# EasyEDA schematic 1-Schematic_Vulcan_Digital_Output.json

## Sheets
1 Connectors: TITLE: Connectors; REV: 1.0; Date: 2021-01-15; Sheet: 1/1; Drawn By: phillo; Company: NPIC
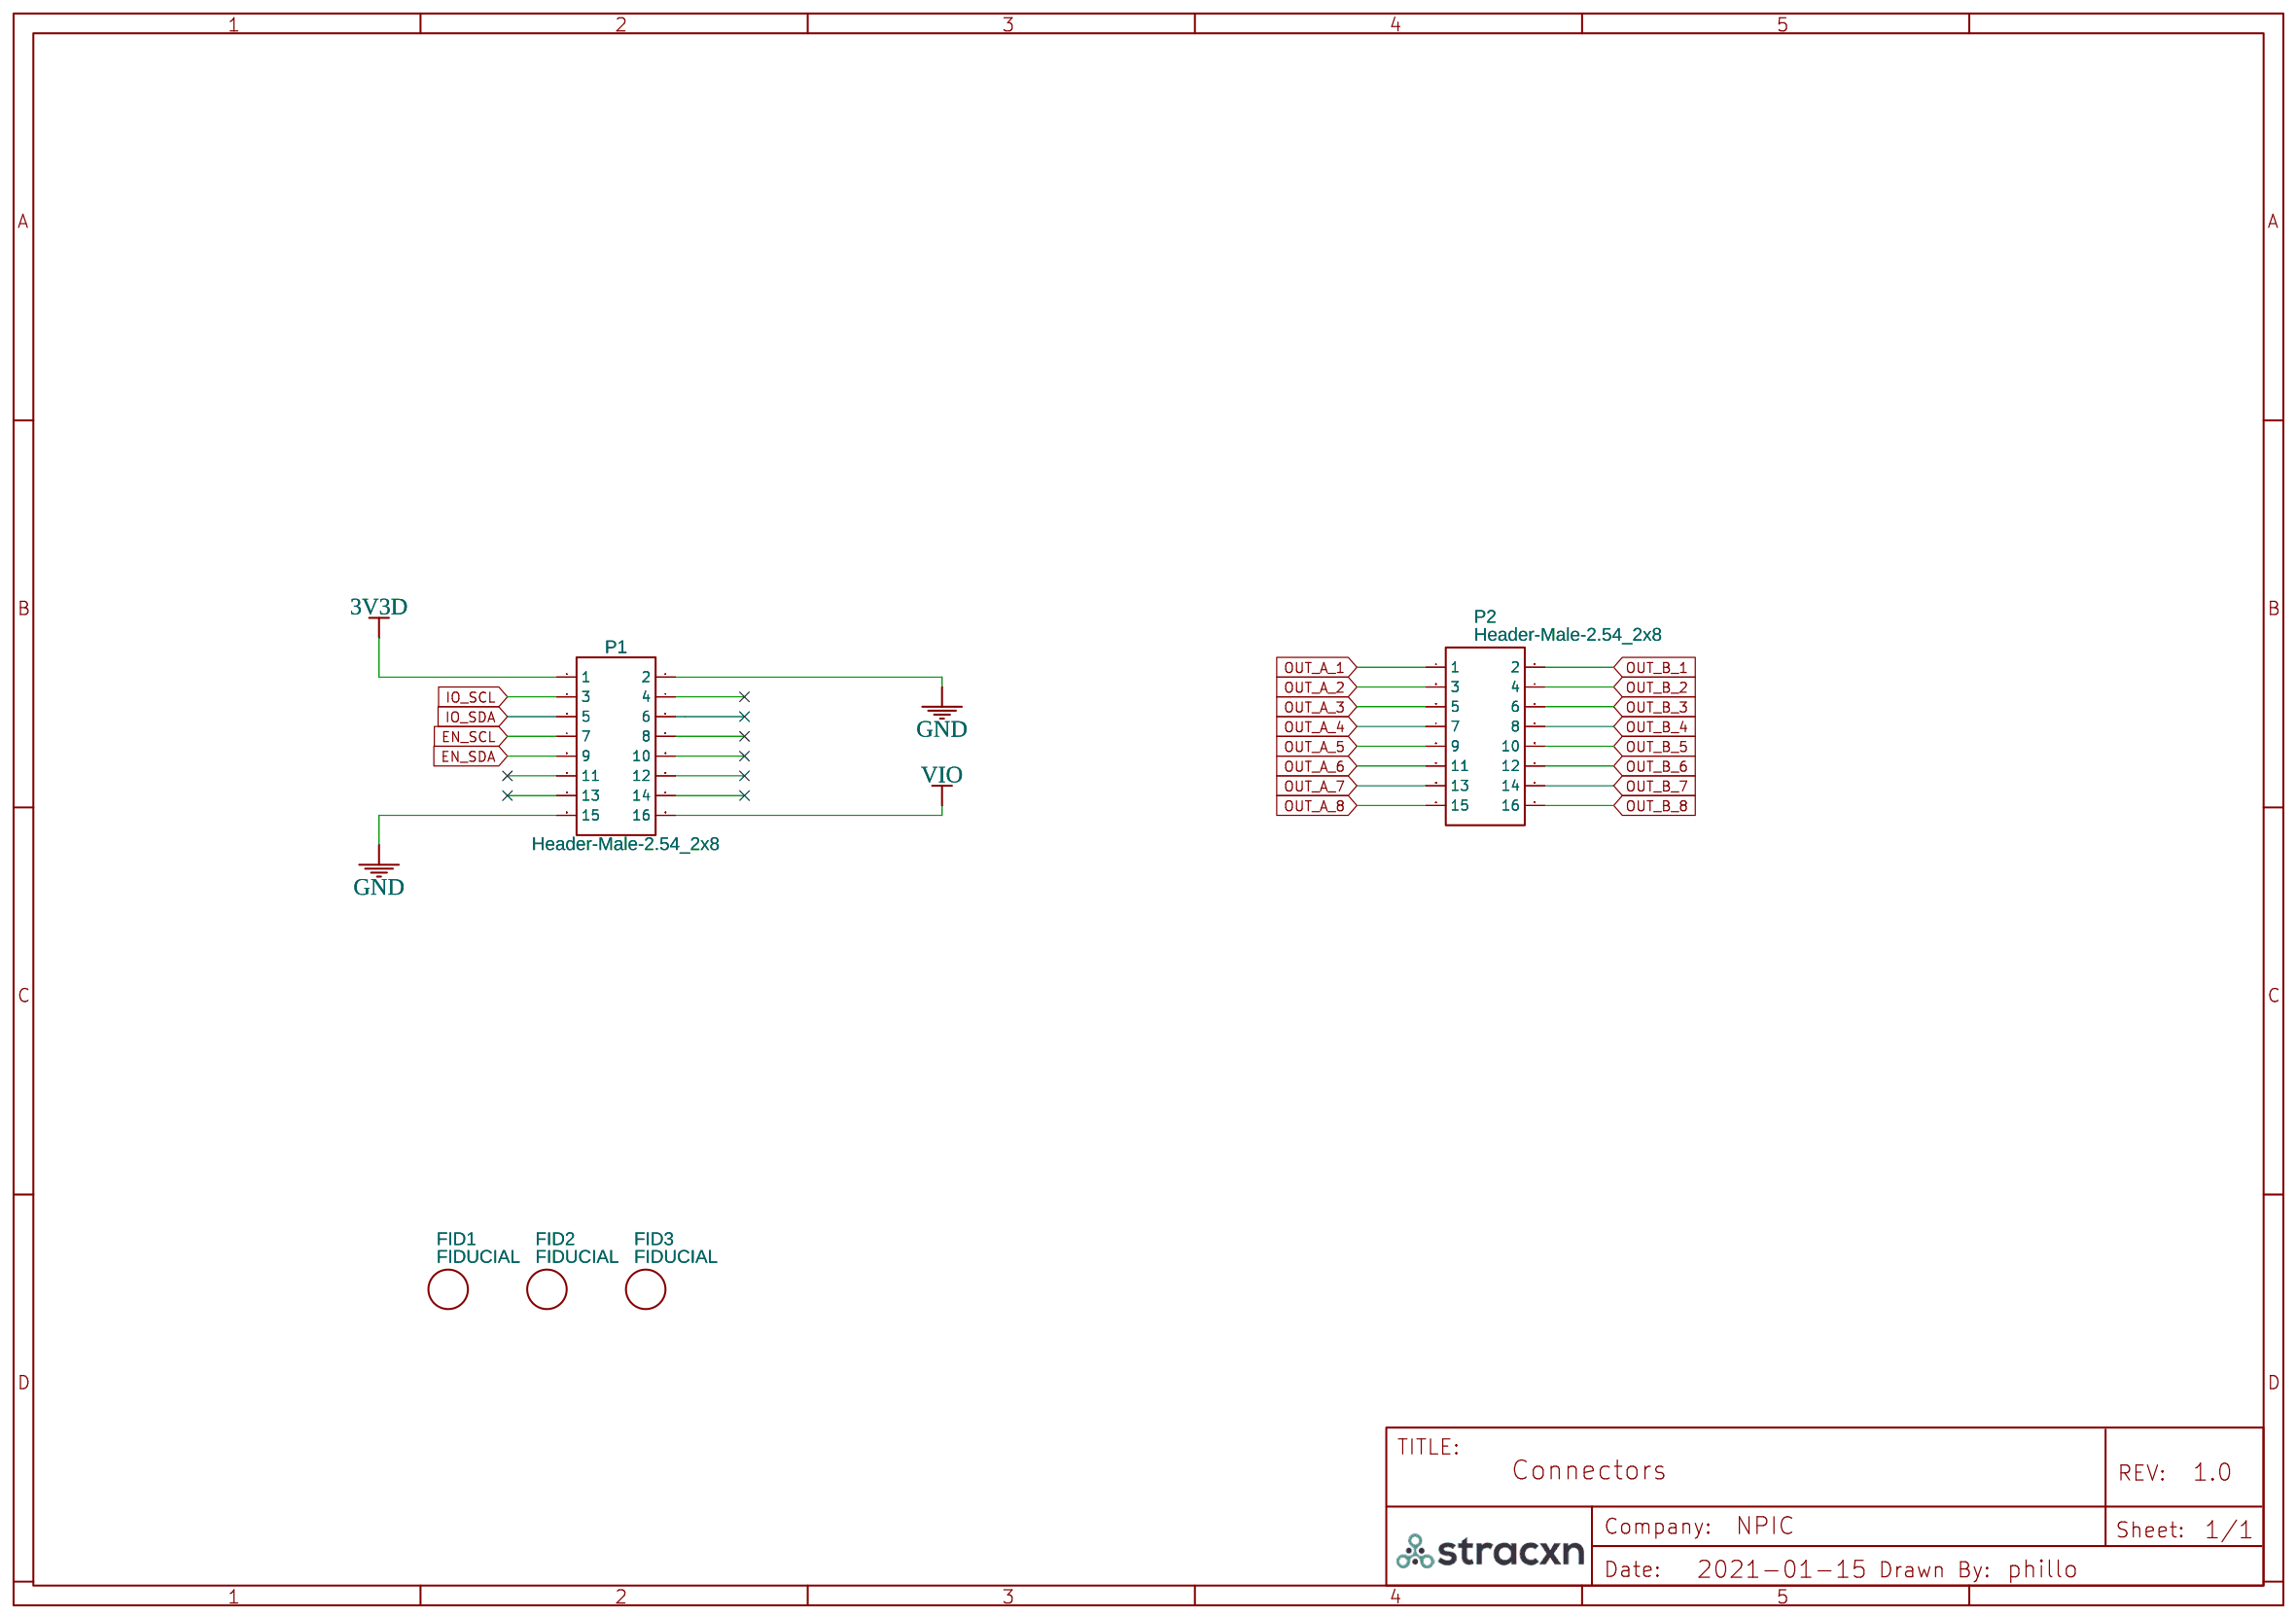
[diagram p0: Connectors]
2 Bank A: TITLE: Bank A
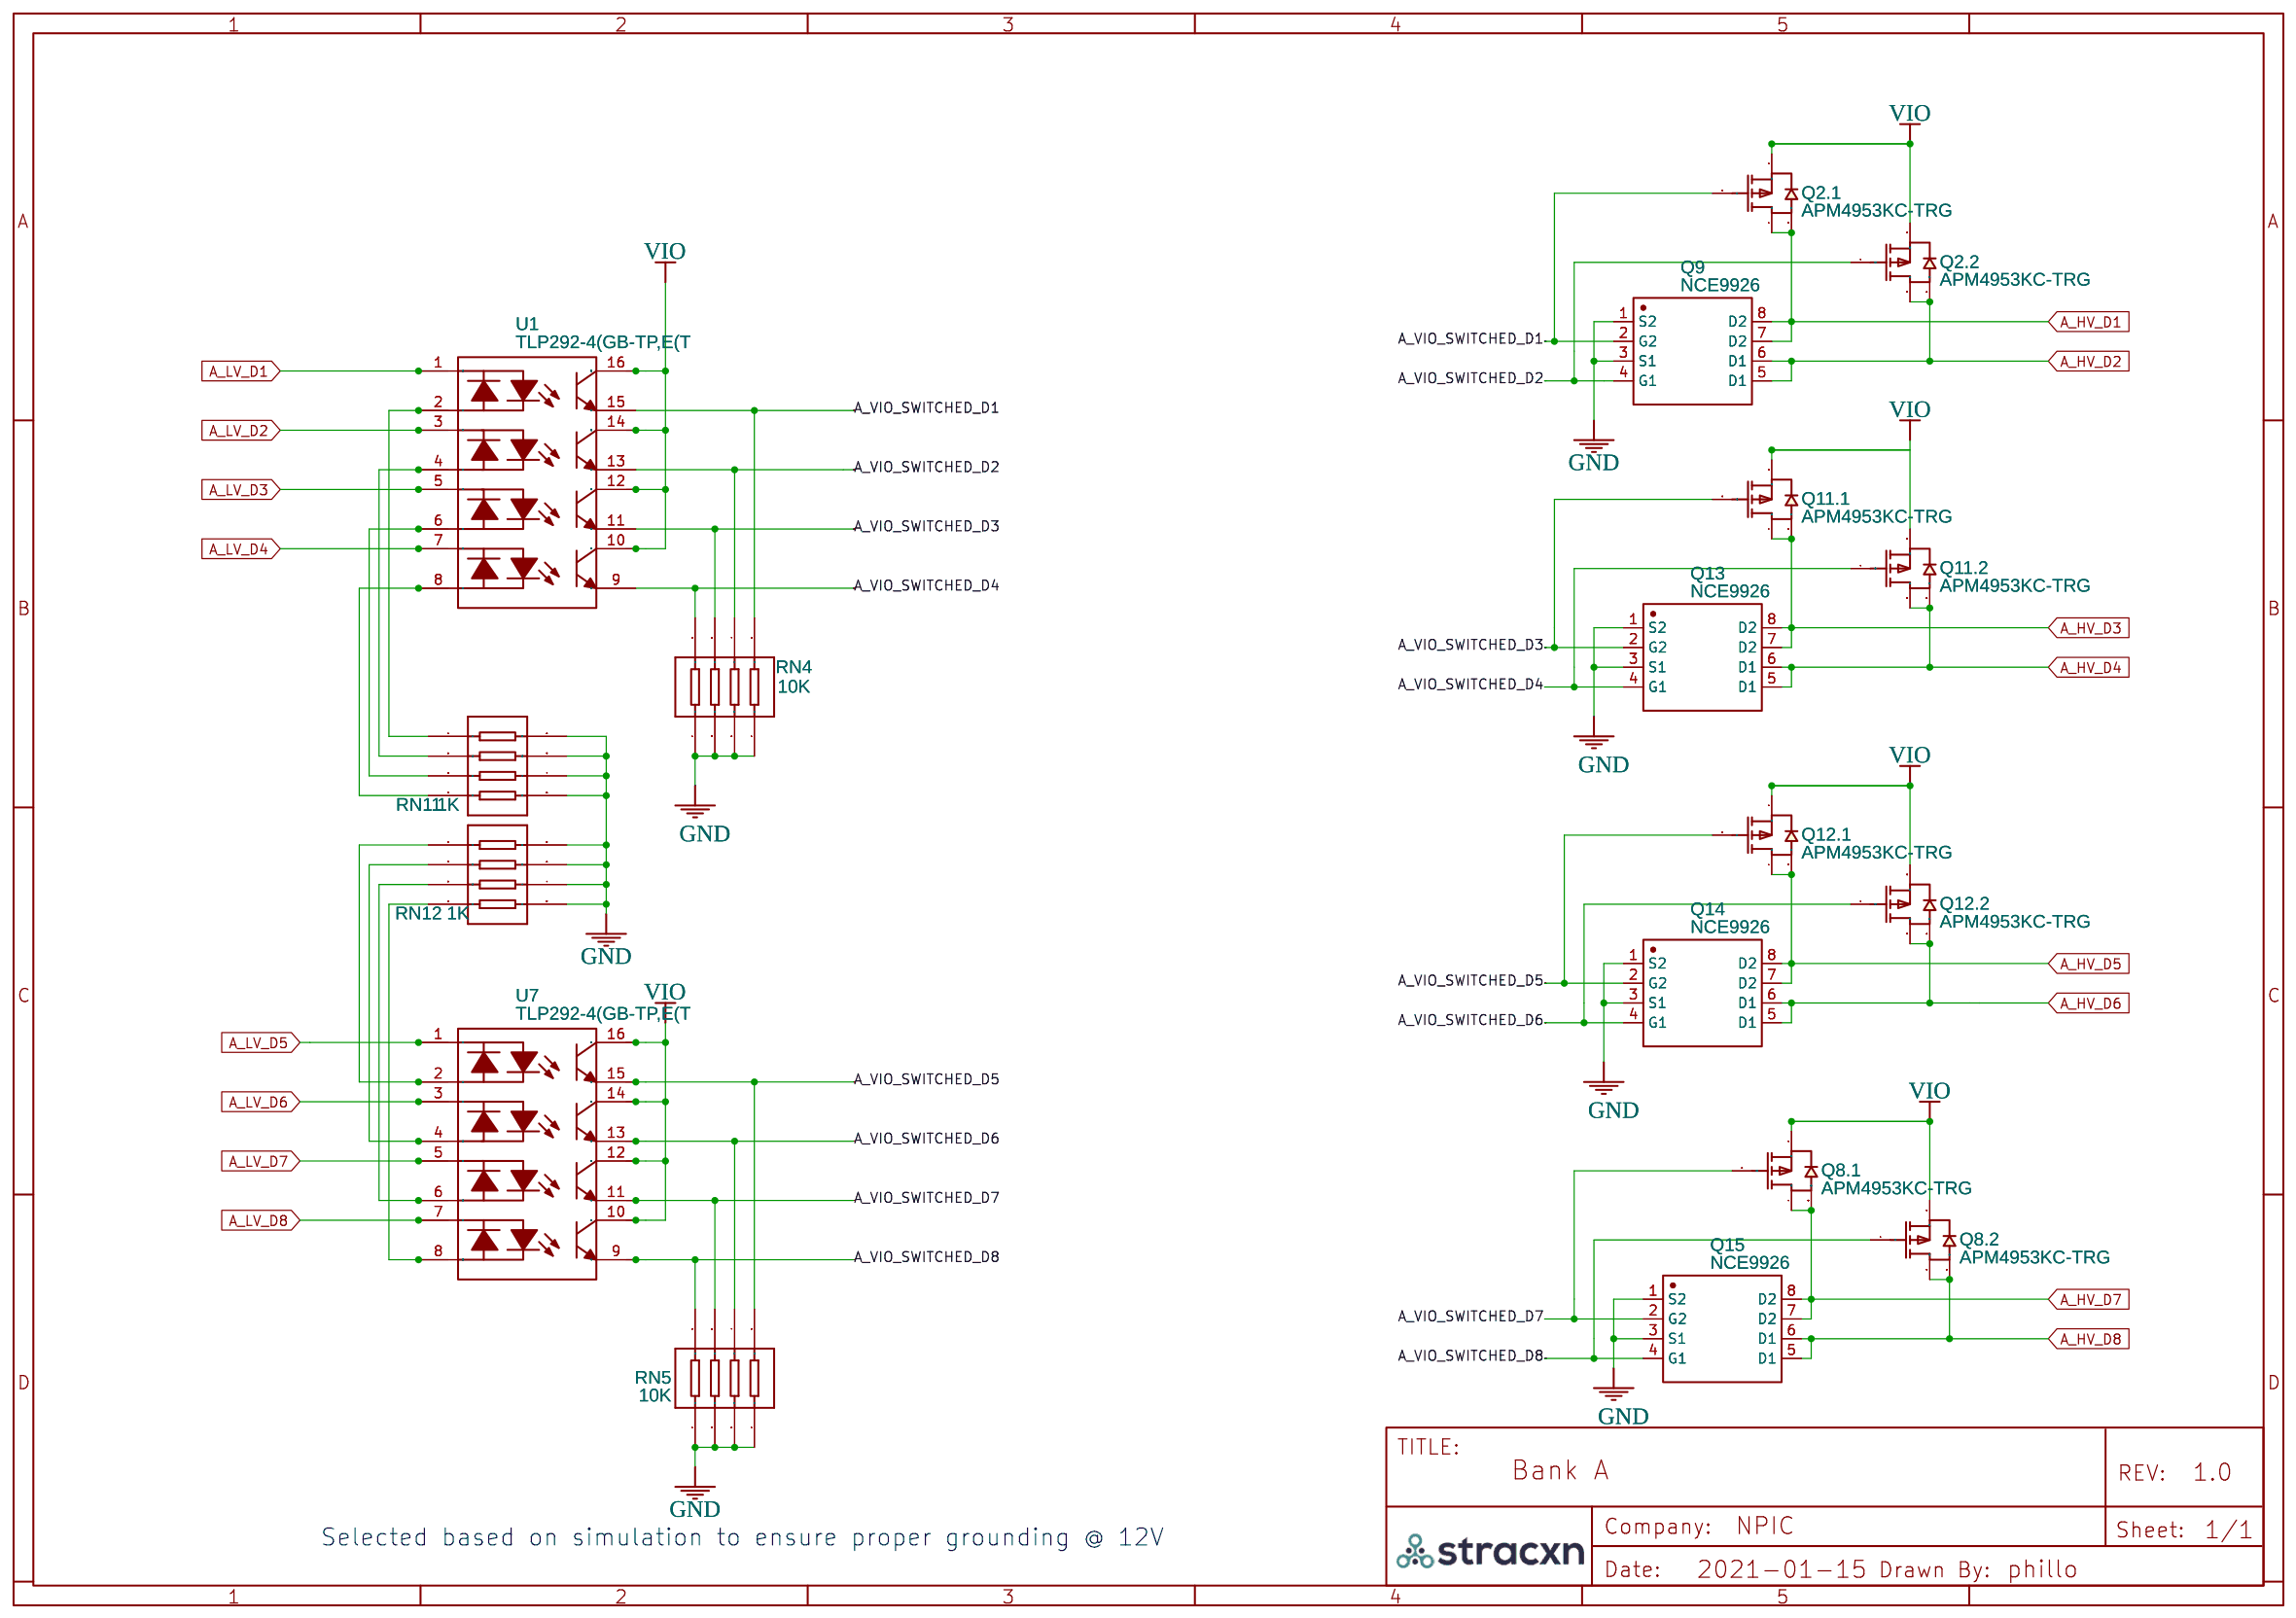
[diagram p1: Bank A]
3 IO Expanders: TITLE: IO Expanders; Drawn By: Phill Ogden
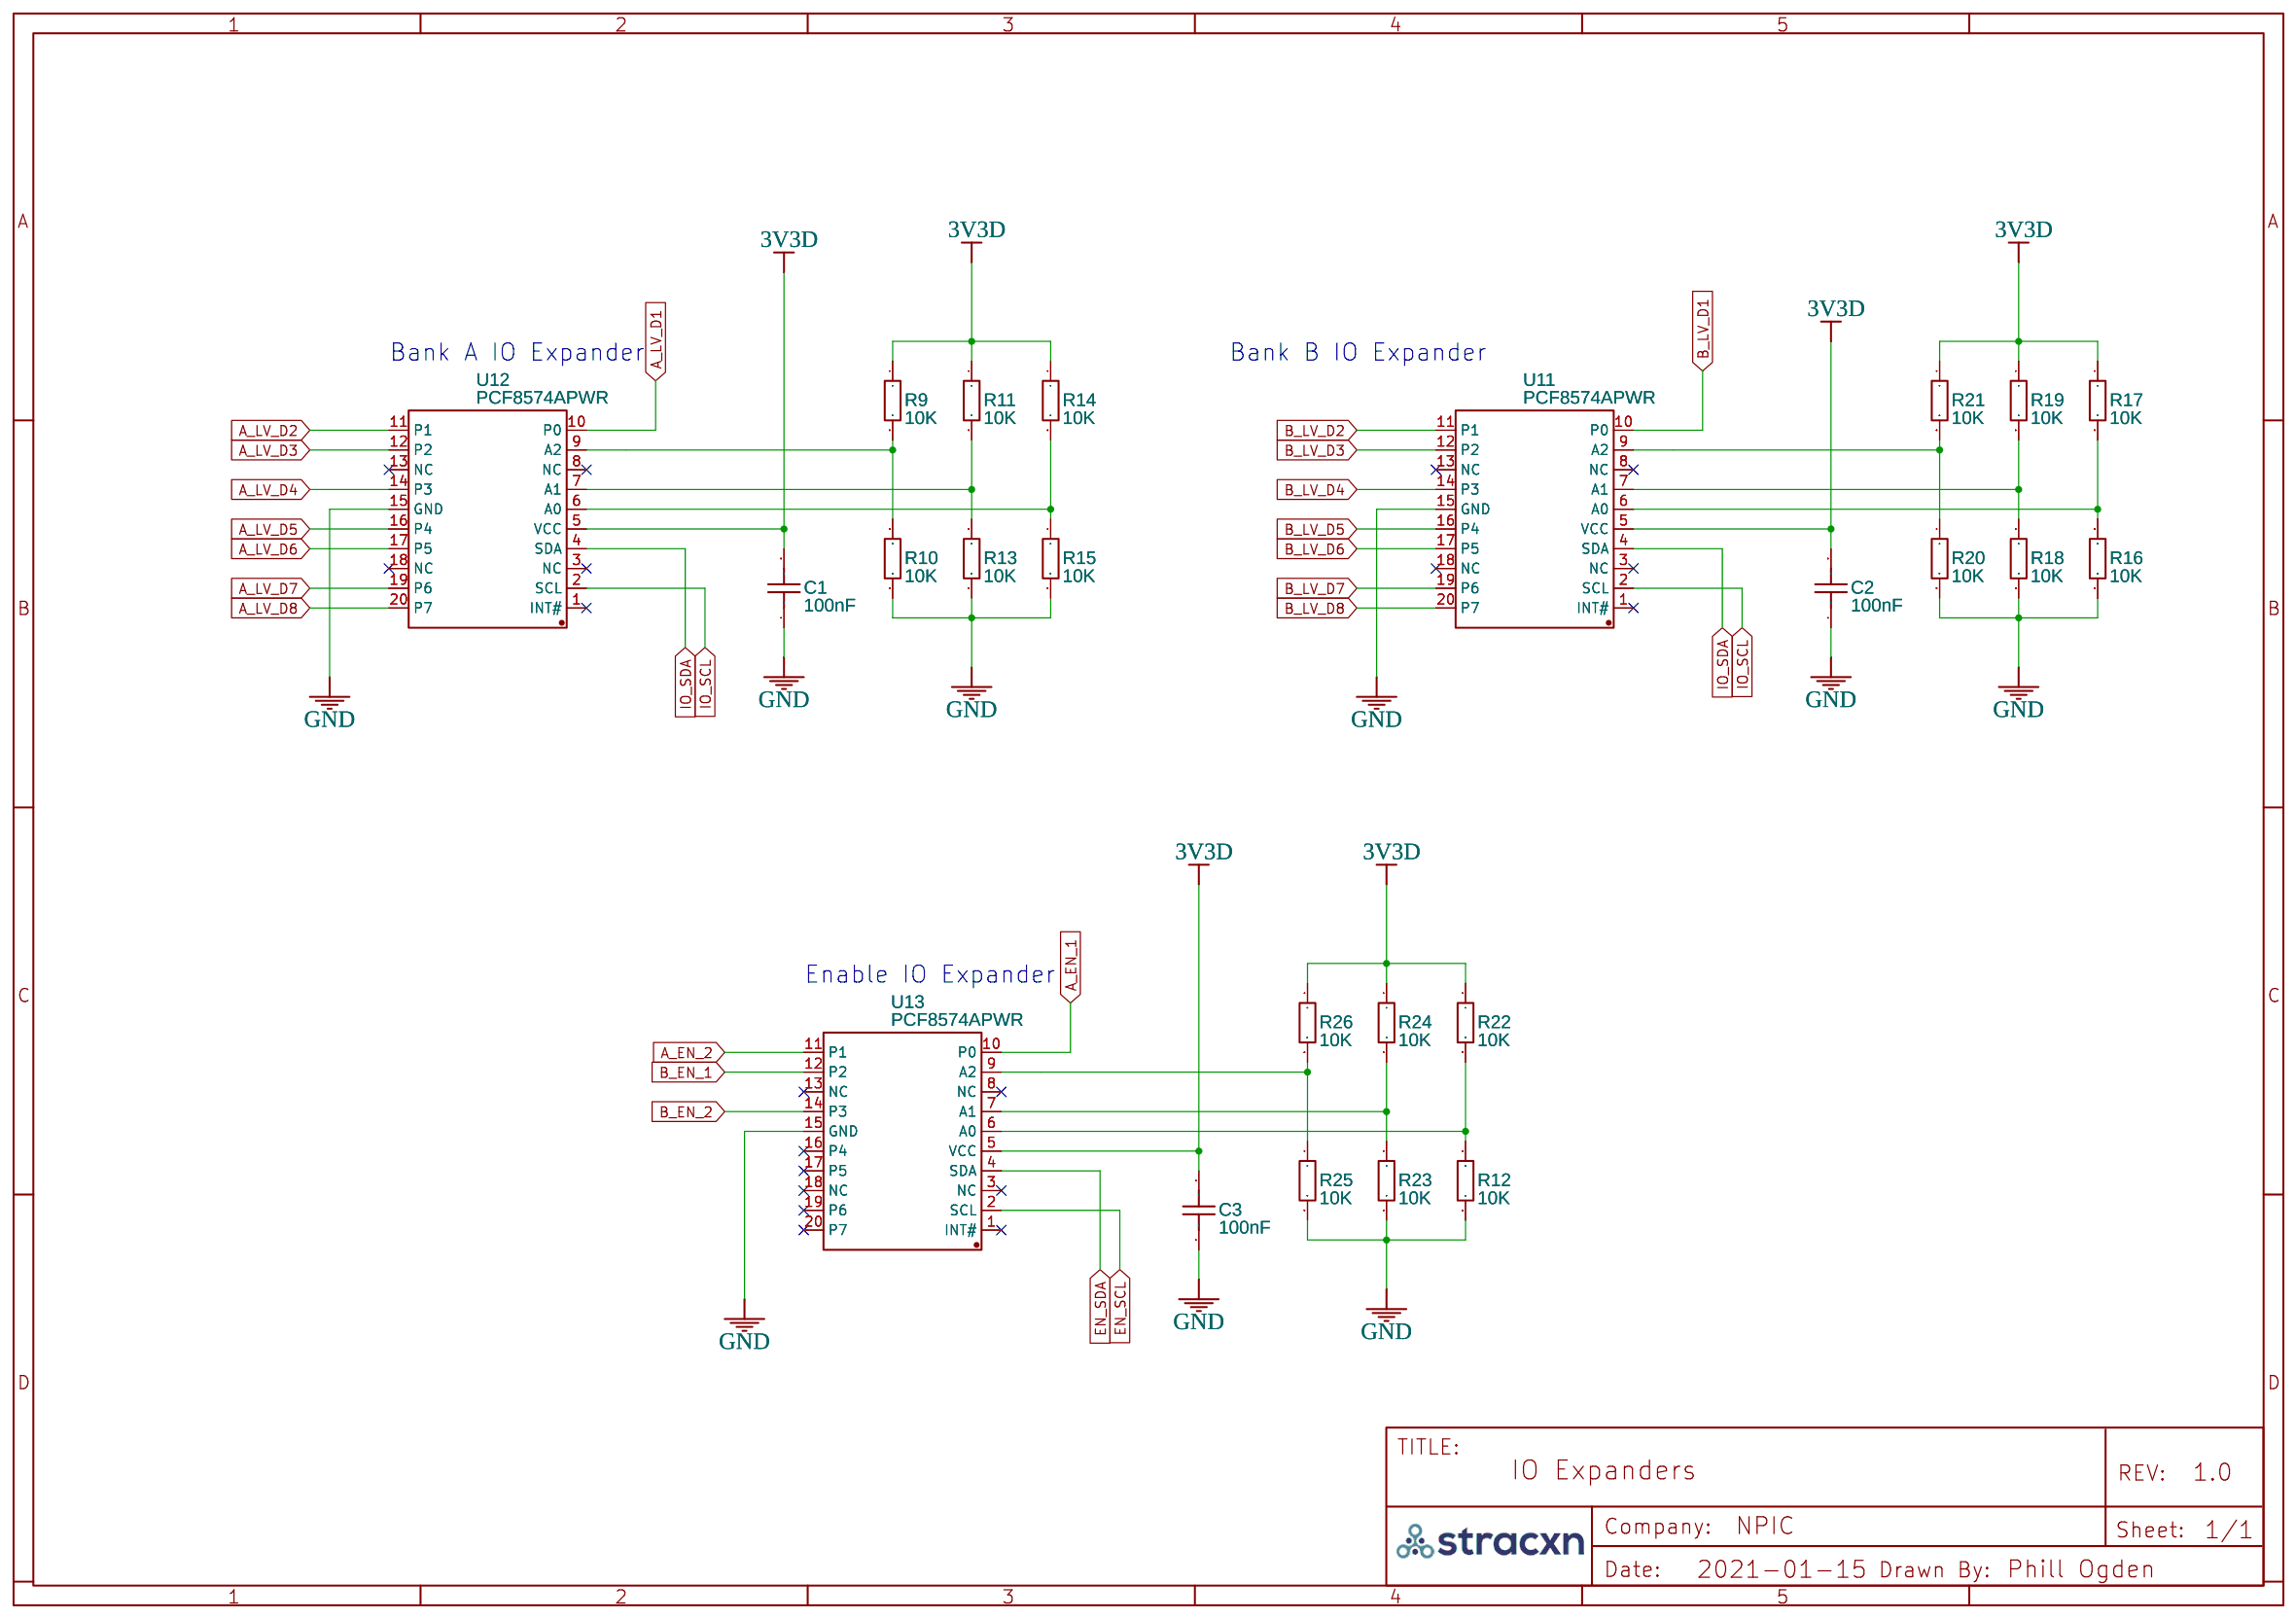
[diagram p2: IO Expanders]
4 Bank B: TITLE: Bank B; Drawn By: Phill Ogden
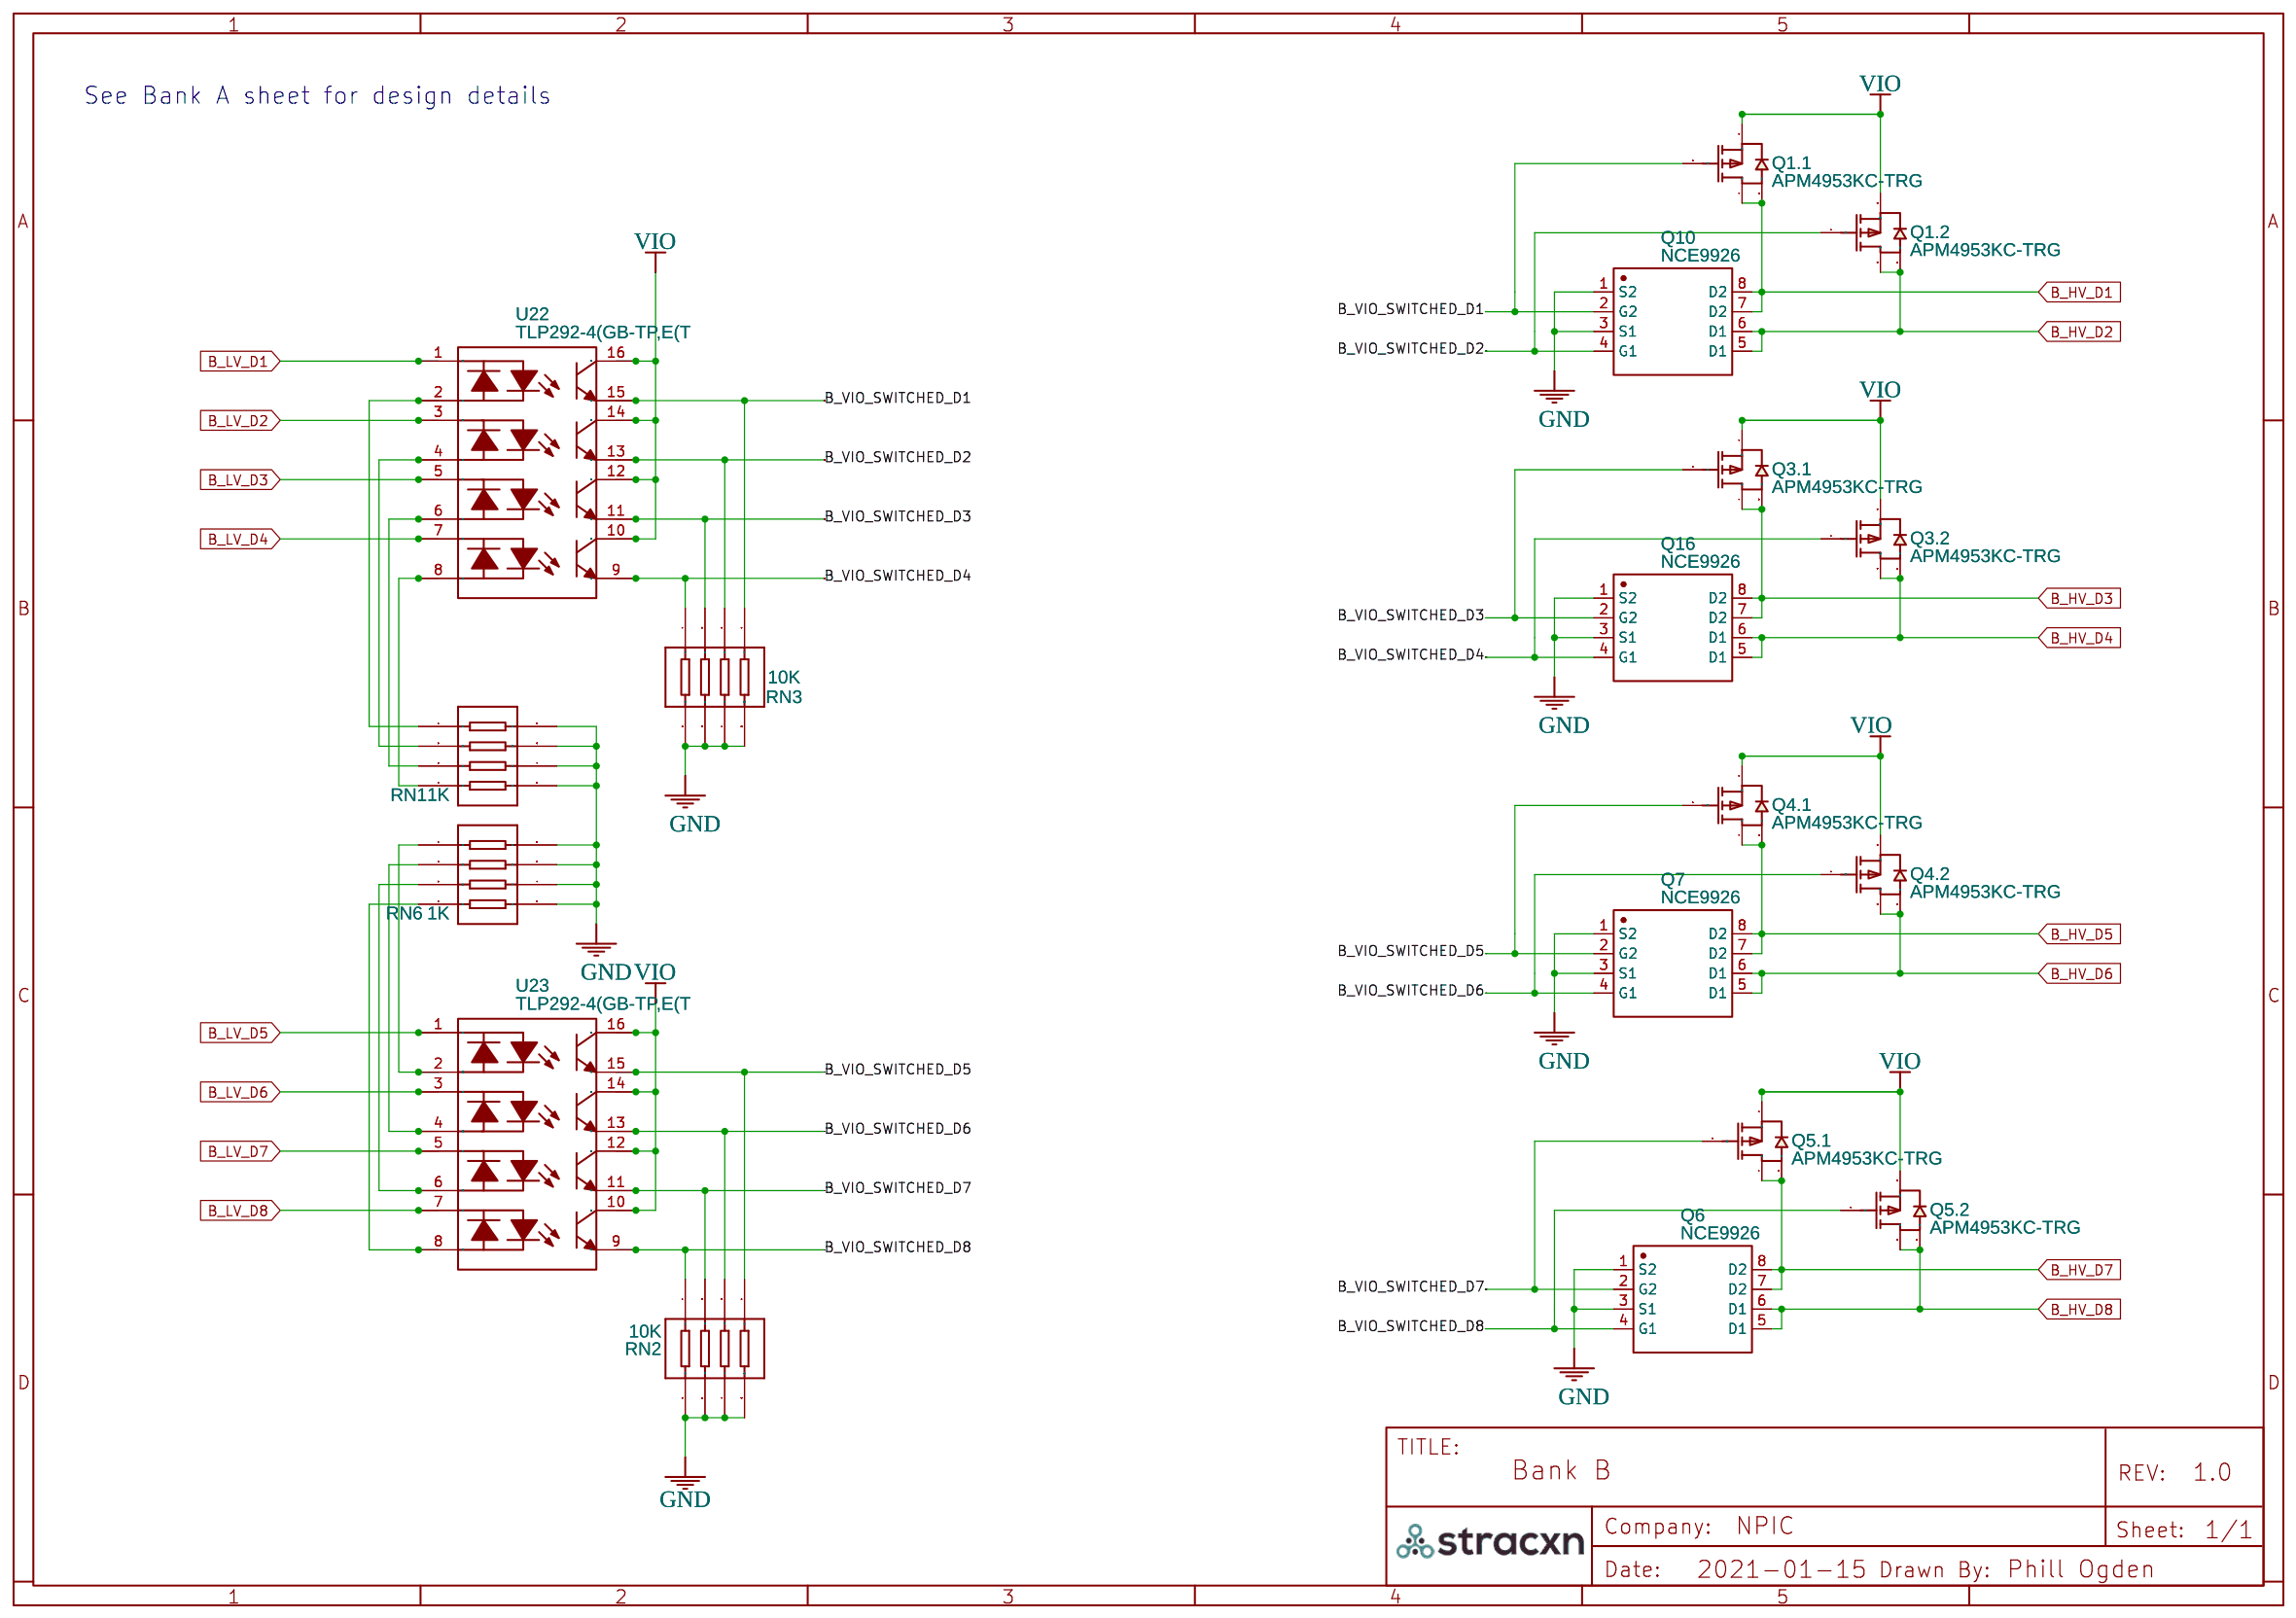
[diagram p3: Bank B]
5 Output: TITLE: Output; Date: 2021-01-18
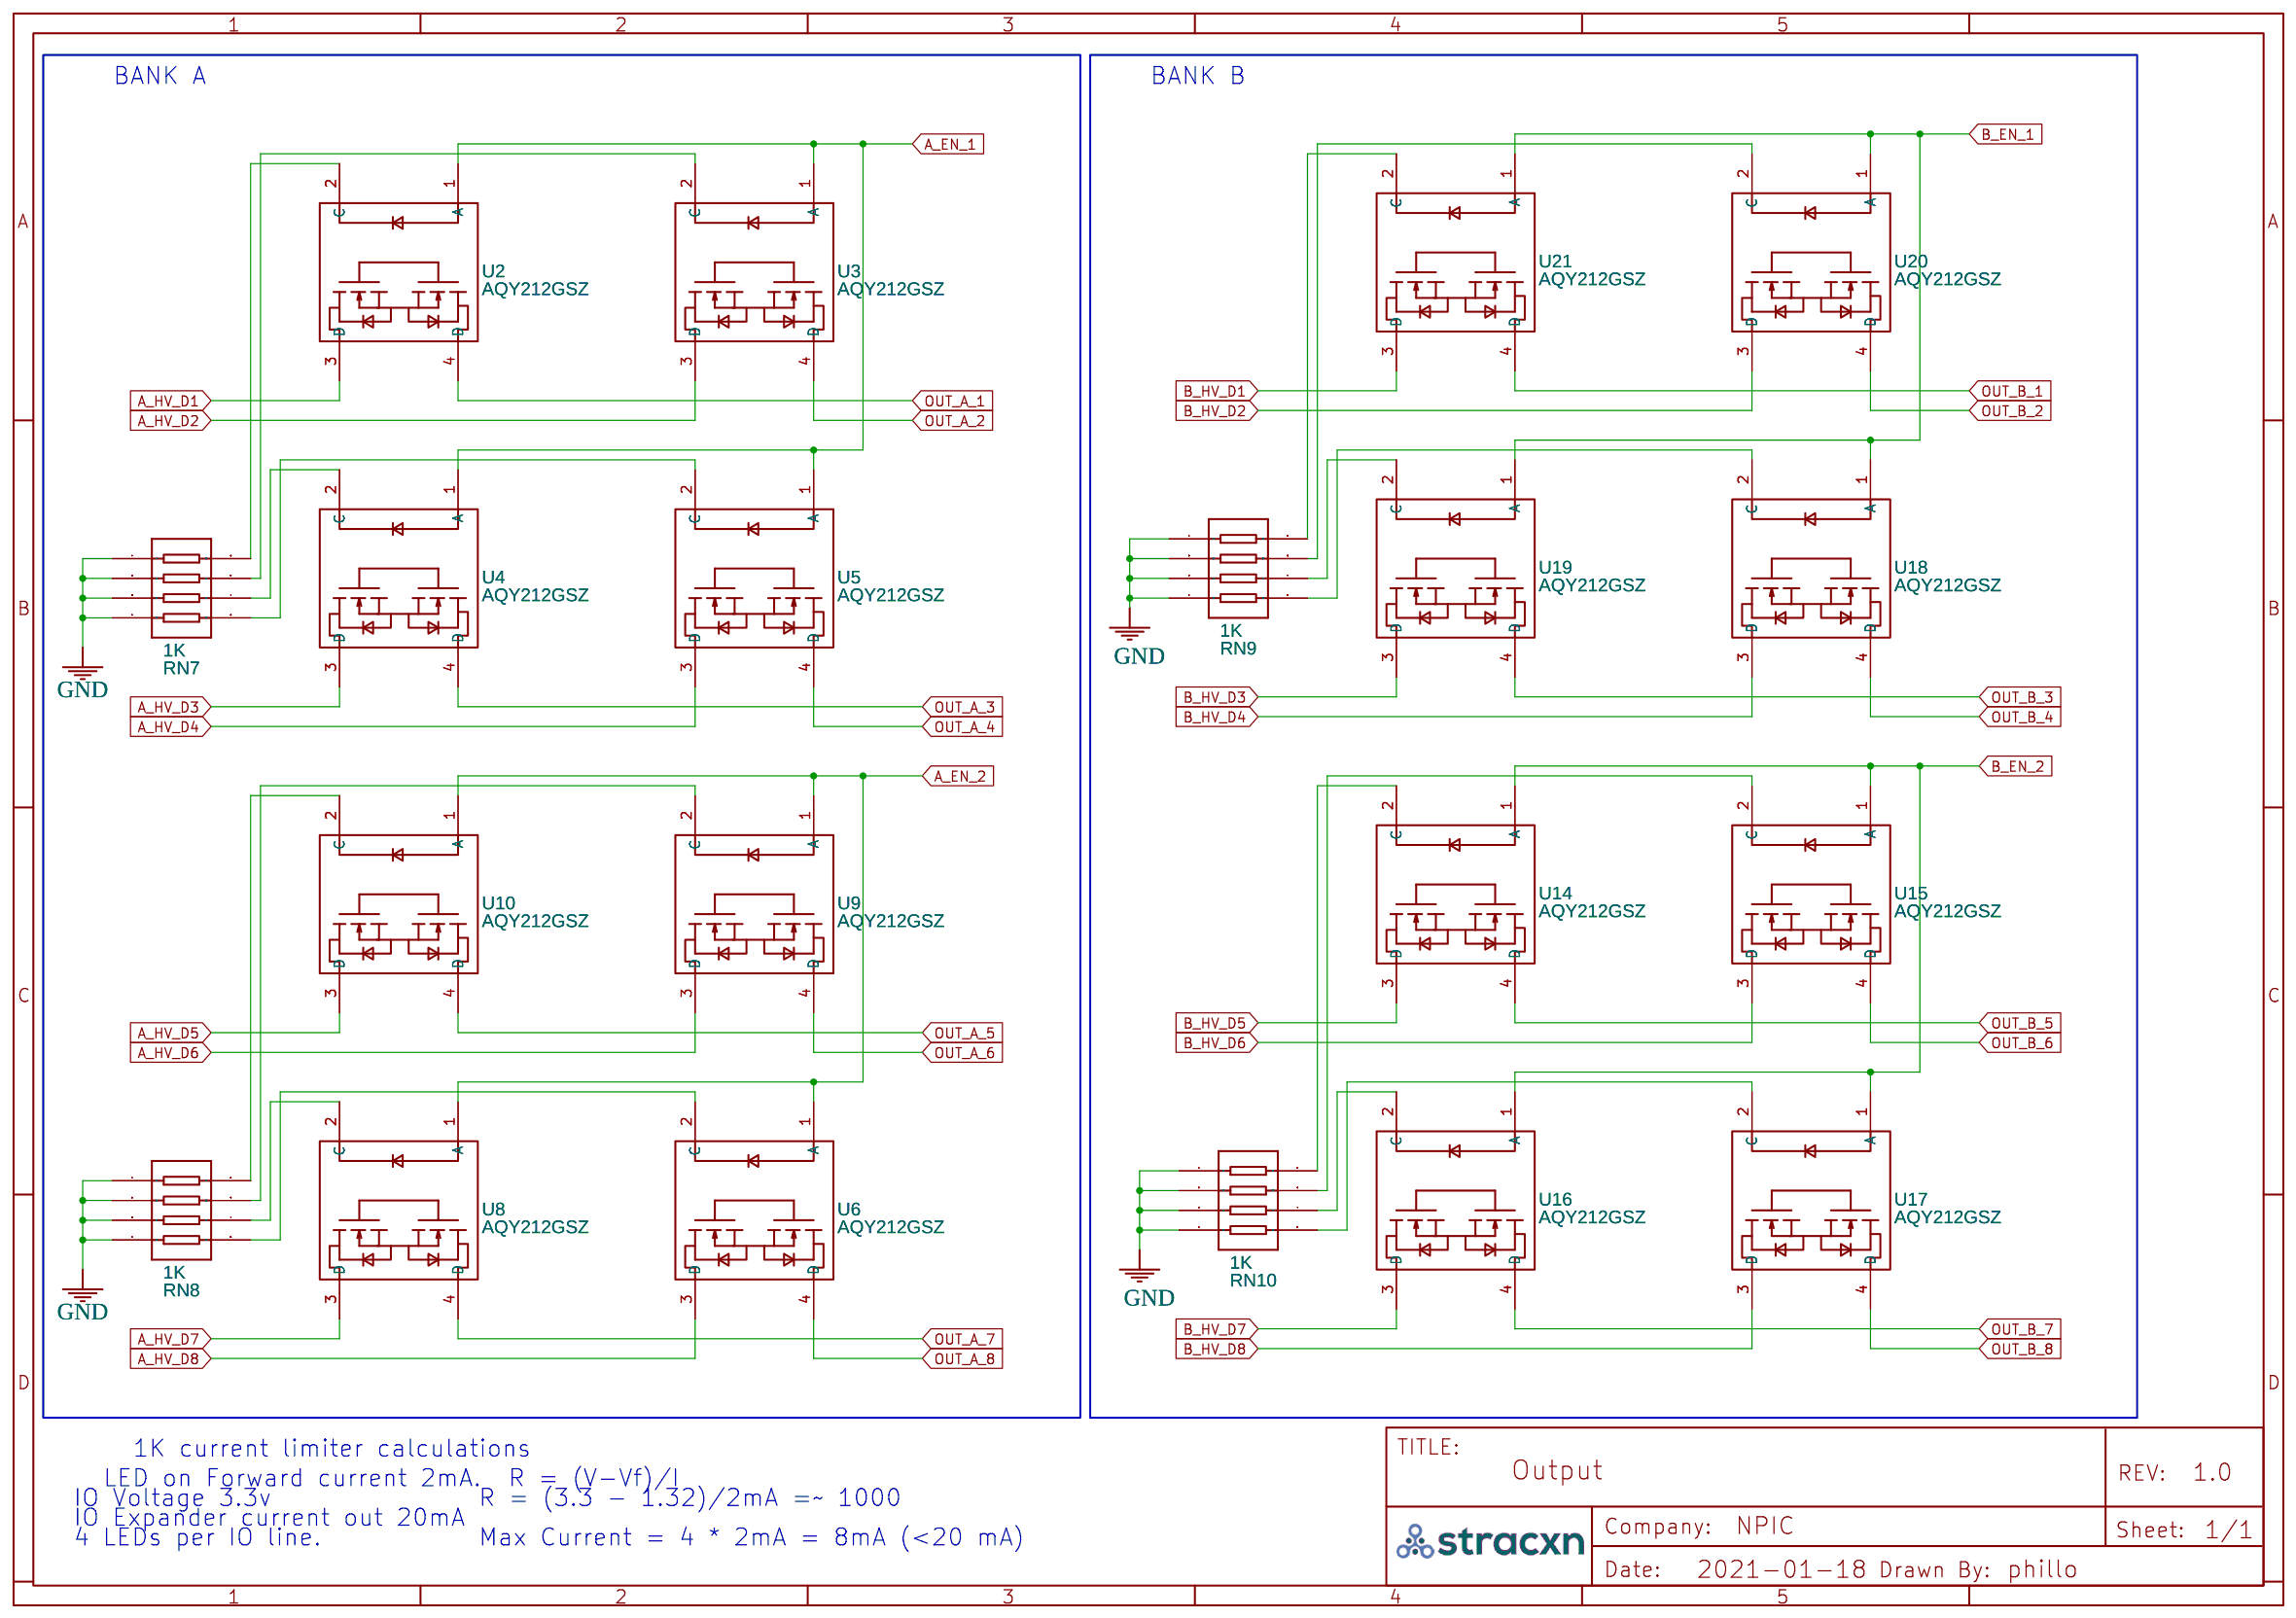
[diagram p4: Output]

## Parts
sheet Bank A
Q2  APM4953KC-TRG  [SOP-8_L4.9-W3.9-P1.27-LS6.0-BL]  (sections 1,2)
Q8  APM4953KC-TRG  [SOP-8_L4.9-W3.9-P1.27-LS6.0-BL]  (sections 1,2)
Q9  NCE9926  [SOP-8_L4.9-W3.9-P1.27-LS6.0-BL]
Q11  APM4953KC-TRG  [SOP-8_L4.9-W3.9-P1.27-LS6.0-BL]  (sections 1,2)
Q12  APM4953KC-TRG  [SOP-8_L4.9-W3.9-P1.27-LS6.0-BL]  (sections 1,2)
Q13  NCE9926  [SOP-8_L4.9-W3.9-P1.27-LS6.0-BL]
Q14  NCE9926  [SOP-8_L4.9-W3.9-P1.27-LS6.0-BL]
Q15  NCE9926  [SOP-8_L4.9-W3.9-P1.27-LS6.0-BL]
RN4  10K  [RES-ARRAY-SMD_0603-8P-L3.2-W1.6-BL]
RN5  10K  [RES-ARRAY-SMD_0603-8P-L3.2-W1.6-BL]
RN11  1K  [RES-ARRAY-SMD_0402-8P-L2.0-W1.0-BL]
RN12  1K  [RES-ARRAY-SMD_0402-8P-L2.0-W1.0-BL]
U1  TLP292-4(GB-TP,E(T  [SO-16_L10.3-W4.4-P1.27-LS7.0-BL]
U7  TLP292-4(GB-TP,E(T  [SO-16_L10.3-W4.4-P1.27-LS7.0-BL]
sheet Bank B
Q1  APM4953KC-TRG  [SOP-8_L4.9-W3.9-P1.27-LS6.0-BL]  (sections 1,2)
Q3  APM4953KC-TRG  [SOP-8_L4.9-W3.9-P1.27-LS6.0-BL]  (sections 1,2)
Q4  APM4953KC-TRG  [SOP-8_L4.9-W3.9-P1.27-LS6.0-BL]  (sections 1,2)
Q5  APM4953KC-TRG  [SOP-8_L4.9-W3.9-P1.27-LS6.0-BL]  (sections 1,2)
Q6  NCE9926  [SOP-8_L4.9-W3.9-P1.27-LS6.0-BL]
Q7  NCE9926  [SOP-8_L4.9-W3.9-P1.27-LS6.0-BL]
Q10  NCE9926  [SOP-8_L4.9-W3.9-P1.27-LS6.0-BL]
Q16  NCE9926  [SOP-8_L4.9-W3.9-P1.27-LS6.0-BL]
RN1  1K  [RES-ARRAY-SMD_0402-8P-L2.0-W1.0-BL]
RN2  10K  [RES-ARRAY-SMD_0603-8P-L3.2-W1.6-BL]
RN3  10K  [RES-ARRAY-SMD_0603-8P-L3.2-W1.6-BL]
RN6  1K  [RES-ARRAY-SMD_0402-8P-L2.0-W1.0-BL]
U22  TLP292-4(GB-TP,E(T  [SO-16_L10.3-W4.4-P1.27-LS7.0-BL]
U23  TLP292-4(GB-TP,E(T  [SO-16_L10.3-W4.4-P1.27-LS7.0-BL]
sheet Connectors
FID1  FIDUCIAL  [FIDUCIAL_1MM]
FID2  FIDUCIAL  [FIDUCIAL_1MM]
FID3  FIDUCIAL  [FIDUCIAL_1MM]
P1  Header-Male-2.54_2x8  [HDR-TH_16P-P2.54-V-M-R2-C8-S2.54]
P2  Header-Male-2.54_2x8  [HDR-TH_16P-P2.54-V-M-R2-C8-S2.54]
sheet IO Expanders
C1  100nF  [C0603]
C2  100nF  [C0603]
C3  100nF  [C0603]
R9  10K  [R0603]
R10  10K  [R0603]
R11  10K  [R0603]
R12  10K  [R0603]
R13  10K  [R0603]
R14  10K  [R0603]
R15  10K  [R0603]
R16  10K  [R0603]
R17  10K  [R0603]
R18  10K  [R0603]
R19  10K  [R0603]
R20  10K  [R0603]
R21  10K  [R0603]
R22  10K  [R0603]
R23  10K  [R0603]
R24  10K  [R0603]
R25  10K  [R0603]
R26  10K  [R0603]
U11  PCF8574APWR  [ETSSOP20_L6.5-W4.4-P0.65-LS6.4-BL]
U12  PCF8574APWR  [ETSSOP20_L6.5-W4.4-P0.65-LS6.4-BL]
U13  PCF8574APWR  [ETSSOP20_L6.5-W4.4-P0.65-LS6.4-BL]
sheet Output
RN7  1K  [RES-ARRAY-SMD_0402-8P-L2.0-W1.0-BL]
RN8  1K  [RES-ARRAY-SMD_0402-8P-L2.0-W1.0-BL]
RN9  1K  [RES-ARRAY-SMD_0402-8P-L2.0-W1.0-BL]
RN10  1K  [RES-ARRAY-SMD_0402-8P-L2.0-W1.0-BL]
U2  AQY212GSZ  [SOP-4_L4.3-W4.4-P2.54-LS7.0-BL]
U3  AQY212GSZ  [SOP-4_L4.3-W4.4-P2.54-LS7.0-BL]
U4  AQY212GSZ  [SOP-4_L4.3-W4.4-P2.54-LS7.0-BL]
U5  AQY212GSZ  [SOP-4_L4.3-W4.4-P2.54-LS7.0-BL]
U6  AQY212GSZ  [SOP-4_L4.3-W4.4-P2.54-LS7.0-BL]
U8  AQY212GSZ  [SOP-4_L4.3-W4.4-P2.54-LS7.0-BL]
U9  AQY212GSZ  [SOP-4_L4.3-W4.4-P2.54-LS7.0-BL]
U10  AQY212GSZ  [SOP-4_L4.3-W4.4-P2.54-LS7.0-BL]
U14  AQY212GSZ  [SOP-4_L4.3-W4.4-P2.54-LS7.0-BL]
U15  AQY212GSZ  [SOP-4_L4.3-W4.4-P2.54-LS7.0-BL]
U16  AQY212GSZ  [SOP-4_L4.3-W4.4-P2.54-LS7.0-BL]
U17  AQY212GSZ  [SOP-4_L4.3-W4.4-P2.54-LS7.0-BL]
U18  AQY212GSZ  [SOP-4_L4.3-W4.4-P2.54-LS7.0-BL]
U19  AQY212GSZ  [SOP-4_L4.3-W4.4-P2.54-LS7.0-BL]
U20  AQY212GSZ  [SOP-4_L4.3-W4.4-P2.54-LS7.0-BL]
U21  AQY212GSZ  [SOP-4_L4.3-W4.4-P2.54-LS7.0-BL]

## Library data of the parts
Q1-Q5 Q8 Q11 Q12 = APM4953KC-TRG: Supplier Part: C20897; Supplier: LCSC; Manufacturer: ANPEC; subpart_no: 1; image: http://image.lceda.cn/szlcsc/C20897.jpg
Q6 Q7 Q9 Q10 Q13-Q16 = NCE9926: Supplier: LCSC; Manufacturer: Ncepower; Supplier Part: C126153; SMT Type: Extend; JLCPCB SMD: Yes; LCSC Assembly: Yes
RN2-RN5 = 4D03WGJ0103T5E: Supplier: LCSC; Manufacturer: UniOhm; Supplier Part: C29718; SMT Type: Basic; JLCPCB SMD: Yes; LCSC Assembly: Yes
RN1 RN6-RN12 = 4D02WGJ0102TCE: Supplier: LCSC; Manufacturer: UniOhm; Supplier Part: C25726; SMT Type: Basic; JLCPCB SMD: Yes; LCSC Assembly: Yes
U1 U7 U22 U23 = TLP292-4(GB-TP,E(T: Supplier: LCSC; Manufacturer: TOSHIBA; Supplier Part: C95713; SMT Type: Extend; JLCPCB SMD: Yes; LCSC Assembly: Yes
FID1-FID3 = FIDUCIAL: Contributor: Adafruit
P1 P2 = Header-Male-2.54_2x8: Supplier: LCSC; Manufacturer: BOOMELE; Manufacturer Part: Double row straight 2*8Headers  Pins 2.54mm; image: //image.lceda.cn/szlcsc/C68234.jpg; Supplier Part: C68234; LCSC Assembly: Yes; SMT Type: Extend
C1-C3 = CC0603KRX7R9BB104: Supplier: LCSC; Manufacturer: YAGEO; Supplier Part: C14663; SMT Type: Basic; JLCPCB SMD: Yes; LCSC Assembly: Yes
R9-R26 = 0603WAF1002T5E: Supplier: LCSC; Manufacturer: UniOhm; Supplier Part: C25804; SMT Type: Basic; JLCPCB SMD: Yes; LCSC Assembly: Yes
U11-U13 = PCF8574APWR: Supplier: LCSC; Supplier Part: C94361; Manufacturer: Texas Instruments; Contributor: LCSC; SMT Type: Extend; JLCPCB SMD: Yes; LCSC Assembly: Yes
U2-U6 U8-U10 U14-U21 = AQY212GSZ: Supplier: LCSC; Manufacturer: PANASONIC; Contributor: LCSC; Supplier Part: C129283; SMT Type: Extend; JLCPCB SMD: Yes; LCSC Assembly: Yes

## Nets
3V3D: C1.2 C2.2 C3.2 P1.1 R9.1 R11.1 R14.1 R17.1 R19.1 R21.1 R22.1 R24.1 R26.1 U11.5(VCC) U12.5(VCC) U13.5(VCC)
GND: C1.1 C2.1 C3.1 P1.2 P1.15 Q6.1(S2) Q6.3(S1) Q7.1(S2) Q7.3(S1) Q9.1(S2) Q9.3(S1) Q10.1(S2) Q10.3(S1) Q13.1(S2) Q13.3(S1) Q14.1(S2) Q14.3(S1) Q15.1(S2) Q15.3(S1) Q16.1(S2) Q16.3(S1) R10.2 R12.2 R13.2 R15.2 R16.2 R18.2 R20.2 R23.2 R25.2 RN1.5 RN1.6 RN1.7 RN1.8 RN2.5 RN2.6 RN2.7 RN2.8 RN3.5 RN3.6 RN3.7 RN3.8 RN4.1 RN4.2 RN4.3 RN4.4 RN5.1 RN5.2 RN5.3 RN5.4 RN6.5 RN6.6 RN6.7 RN6.8 RN7.1 RN7.2 RN7.3 RN7.4 RN8.1 RN8.2 RN8.3 RN8.4 RN9.1 RN9.2 RN9.3 RN9.4 RN10.1 RN10.2 RN10.3 RN10.4 RN11.5 RN11.6 RN11.7 RN11.8 RN12.5 RN12.6 RN12.7 RN12.8 U11.15(GND) U12.15(GND) U13.15(GND)
A_EN_1: U2.1(A) U3.1(A) U4.1(A) U5.1(A) U13.10(P0)
A_EN_2: U6.1(A) U8.1(A) U9.1(A) U10.1(A) U13.11(P1)
A_HV_D1: Q2.7(D1) Q2.8(D1) Q9.7(D2) Q9.8(D2) U2.3(D)
A_HV_D2: Q2.5(D2) Q2.6(D2) Q9.5(D1) Q9.6(D1) U3.3(D)
A_HV_D3: Q11.7(D1) Q11.8(D1) Q13.7(D2) Q13.8(D2) U4.3(D)
A_HV_D4: Q11.5(D2) Q11.6(D2) Q13.5(D1) Q13.6(D1) U5.3(D)
A_HV_D5: Q12.7(D1) Q12.8(D1) Q14.7(D2) Q14.8(D2) U10.3(D)
A_HV_D6: Q12.5(D2) Q12.6(D2) Q14.5(D1) Q14.6(D1) U9.3(D)
A_HV_D7: Q8.7(D1) Q8.8(D1) Q15.7(D2) Q15.8(D2) U8.3(D)
A_HV_D8: Q8.5(D2) Q8.6(D2) Q15.5(D1) Q15.6(D1) U6.3(D)
A_LV_D1: U1.1(AN) U12.10(P0)
A_LV_D2: U1.3(AN) U12.11(P1)
A_LV_D3: U1.5(AN) U12.12(P2)
A_LV_D4: U1.7(AN) U12.14(P3)
A_LV_D5: U7.1(AN) U12.16(P4)
A_LV_D6: U7.3(AN) U12.17(P5)
A_LV_D7: U7.5(AN) U12.19(P6)
A_LV_D8: U7.7(AN) U12.20(P7)
A_VIO_SWITCHED_D1: Q2.2(G1) Q9.2(G2) RN4.8 U1.15(EM)
A_VIO_SWITCHED_D2: Q2.4(G2) Q9.4(G1) RN4.7 U1.13(EM)
A_VIO_SWITCHED_D3: Q11.2(G1) Q13.2(G2) RN4.6 U1.11(EM)
A_VIO_SWITCHED_D4: Q11.4(G2) Q13.4(G1) RN4.5 U1.9(EM)
A_VIO_SWITCHED_D5: Q12.2(G1) Q14.2(G2) RN5.8 U7.15(EM)
A_VIO_SWITCHED_D6: Q12.4(G2) Q14.4(G1) RN5.7 U7.13(EM)
A_VIO_SWITCHED_D7: Q8.2(G1) Q15.2(G2) RN5.6 U7.11(EM)
A_VIO_SWITCHED_D8: Q8.4(G2) Q15.4(G1) RN5.5 U7.9(EM)
B_EN_1: U13.12(P2) U18.1(A) U19.1(A) U20.1(A) U21.1(A)
B_EN_2: U13.14(P3) U14.1(A) U15.1(A) U16.1(A) U17.1(A)
B_HV_D1: Q1.7(D1) Q1.8(D1) Q10.7(D2) Q10.8(D2) U21.3(D)
B_HV_D2: Q1.5(D2) Q1.6(D2) Q10.5(D1) Q10.6(D1) U20.3(D)
B_HV_D3: Q3.7(D1) Q3.8(D1) Q16.7(D2) Q16.8(D2) U19.3(D)
B_HV_D4: Q3.5(D2) Q3.6(D2) Q16.5(D1) Q16.6(D1) U18.3(D)
B_HV_D5: Q4.7(D1) Q4.8(D1) Q7.7(D2) Q7.8(D2) U14.3(D)
B_HV_D6: Q4.5(D2) Q4.6(D2) Q7.5(D1) Q7.6(D1) U15.3(D)
B_HV_D7: Q5.7(D1) Q5.8(D1) Q6.7(D2) Q6.8(D2) U16.3(D)
B_HV_D8: Q5.5(D2) Q5.6(D2) Q6.5(D1) Q6.6(D1) U17.3(D)
B_LV_D1: U11.10(P0) U22.1(AN)
B_LV_D2: U11.11(P1) U22.3(AN)
B_LV_D3: U11.12(P2) U22.5(AN)
B_LV_D4: U11.14(P3) U22.7(AN)
B_LV_D5: U11.16(P4) U23.1(AN)
B_LV_D6: U11.17(P5) U23.3(AN)
B_LV_D7: U11.19(P6) U23.5(AN)
B_LV_D8: U11.20(P7) U23.7(AN)
B_VIO_SWITCHED_D1: Q1.2(G1) Q10.2(G2) RN3.1 U22.15(EM)
B_VIO_SWITCHED_D2: Q1.4(G2) Q10.4(G1) RN3.2 U22.13(EM)
B_VIO_SWITCHED_D3: Q3.2(G1) Q16.2(G2) RN3.3 U22.11(EM)
B_VIO_SWITCHED_D4: Q3.4(G2) Q16.4(G1) RN3.4 U22.9(EM)
B_VIO_SWITCHED_D5: Q4.2(G1) Q7.2(G2) RN2.1 U23.15(EM)
B_VIO_SWITCHED_D6: Q4.4(G2) Q7.4(G1) RN2.2 U23.13(EM)
B_VIO_SWITCHED_D7: Q5.2(G1) Q6.2(G2) RN2.3 U23.11(EM)
B_VIO_SWITCHED_D8: Q5.4(G2) Q6.4(G1) RN2.4 U23.9(EM)
EN_SCL: P1.7 U13.2(SCL)
EN_SDA: P1.9 U13.4(SDA)
IO_SCL: P1.3 U11.2(SCL) U12.2(SCL)
IO_SDA: P1.5 U11.4(SDA) U12.4(SDA)
OUT_A_1: P2.1 U2.4(D)
OUT_A_2: P2.3 U3.4(D)
OUT_A_3: P2.5 U4.4(D)
OUT_A_4: P2.7 U5.4(D)
OUT_A_5: P2.9 U10.4(D)
OUT_A_6: P2.11 U9.4(D)
OUT_A_7: P2.13 U8.4(D)
OUT_A_8: P2.15 U6.4(D)
OUT_B_1: P2.2 U21.4(D)
OUT_B_2: P2.4 U20.4(D)
OUT_B_3: P2.6 U19.4(D)
OUT_B_4: P2.8 U18.4(D)
OUT_B_5: P2.10 U14.4(D)
OUT_B_6: P2.12 U15.4(D)
OUT_B_7: P2.14 U16.4(D)
OUT_B_8: P2.16 U17.4(D)
VIO: P1.16 Q1.1(S1) Q1.3(S2) Q2.1(S1) Q2.3(S2) Q3.1(S1) Q3.3(S2) Q4.1(S1) Q4.3(S2) Q5.1(S1) Q5.3(S2) Q8.1(S1) Q8.3(S2) Q11.1(S1) Q11.3(S2) Q12.1(S1) Q12.3(S2) U1.10(COL) U1.12(COL) U1.14(COL) U1.16(COL) U7.10(COL) U7.12(COL) U7.14(COL) U7.16(COL) U22.10(COL) U22.12(COL) U22.14(COL) U22.16(COL) U23.10(COL) U23.12(COL) U23.14(COL) U23.16(COL)
Net-(R9-2): R9.2 R10.1 U12.9(A2)
Net-(R11-2): R11.2 R13.1 U12.7(A1)
Net-(R12-1): R12.1 R22.2 U13.6(A0)
Net-(R14-2): R14.2 R15.1 U12.6(A0)
Net-(R16-1): R16.1 R17.2 U11.6(A0)
Net-(R18-1): R18.1 R19.2 U11.7(A1)
Net-(R20-1): R20.1 R21.2 U11.9(A2)
Net-(R23-1): R23.1 R24.2 U13.7(A1)
Net-(R25-1): R25.1 R26.2 U13.9(A2)
Net-(RN1-1): RN1.1 U22.8(CAT)
Net-(RN1-2): RN1.2 U22.6(CAT)
Net-(RN1-3): RN1.3 U22.4(CAT)
Net-(RN1-4): RN1.4 U22.2(CAT)
Net-(RN6-1): RN6.1 U23.8(CAT)
Net-(RN6-2): RN6.2 U23.6(CAT)
Net-(RN6-3): RN6.3 U23.4(CAT)
Net-(RN6-4): RN6.4 U23.2(CAT)
Net-(RN7-5): RN7.5 U2.2(C)
Net-(RN7-6): RN7.6 U3.2(C)
Net-(RN7-7): RN7.7 U4.2(C)
Net-(RN7-8): RN7.8 U5.2(C)
Net-(RN8-5): RN8.5 U10.2(C)
Net-(RN8-6): RN8.6 U9.2(C)
Net-(RN8-7): RN8.7 U8.2(C)
Net-(RN8-8): RN8.8 U6.2(C)
Net-(RN9-5): RN9.5 U21.2(C)
Net-(RN9-6): RN9.6 U20.2(C)
Net-(RN9-7): RN9.7 U19.2(C)
Net-(RN9-8): RN9.8 U18.2(C)
Net-(RN10-5): RN10.5 U14.2(C)
Net-(RN10-6): RN10.6 U15.2(C)
Net-(RN10-7): RN10.7 U16.2(C)
Net-(RN10-8): RN10.8 U17.2(C)
Net-(RN11-1): RN11.1 U1.8(CAT)
Net-(RN11-2): RN11.2 U1.6(CAT)
Net-(RN11-3): RN11.3 U1.4(CAT)
Net-(RN11-4): RN11.4 U1.2(CAT)
Net-(RN12-1): RN12.1 U7.8(CAT)
Net-(RN12-2): RN12.2 U7.6(CAT)
Net-(RN12-3): RN12.3 U7.4(CAT)
Net-(RN12-4): RN12.4 U7.2(CAT)

Not connected (* = marked no-connect by the designer): P1 4 6 8 10 11 12 13 14; U11 1(INT#)* 3(NC)* 8(NC)* 13(NC)* 18(NC)*; U12 1(INT#)* 3(NC)* 8(NC)* 13(NC)* 18(NC)*; U13 1(INT#)* 3(NC)* 8(NC)* 13(NC)* 16(P4)* 17(P5)* 18(NC)* 19(P6)* 20(P7)*

## Notes on the sheets
sheet 2
- Simulated schematic for IO
- Selected based on simulation to ensure proper grounding @ 12V
sheet 3
- Bank A IO Expander
- Bank B IO Expander
- Enable IO Expander
sheet 4
- See Bank A sheet for design details
sheet 5
- BANK A
- BANK B
- 1K current limiter calculations
- LED on Forward current 2mA.
- R = (V-Vf)/I
- IO Voltage 3.3v
- R = (3.3 - 1.32)/2mA =~ 1000
- IO Expander current out 20mA
- 4 LEDs per IO line.
- Max Current = 4 * 2mA = 8mA (<20 mA)
